# EAGLE schematic receiving end(3) (EAGLE 6.3)
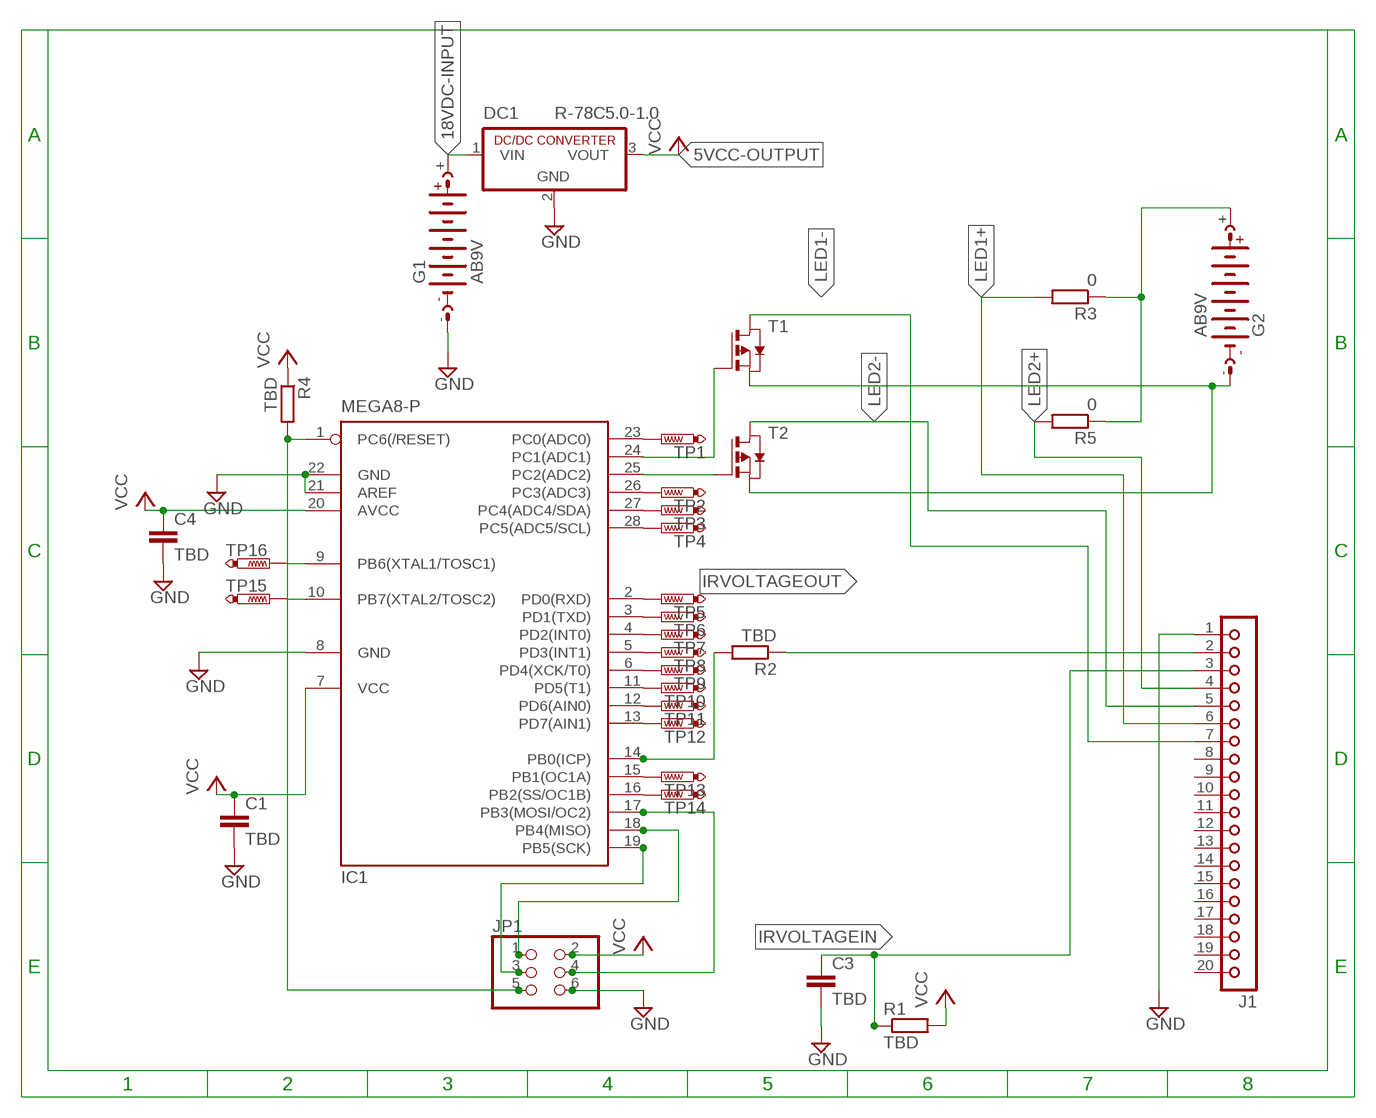
[diagram p0: schematic, sheet 1]

## Parts
C1  TBD  C-EUC0805  [C0805]
C3  TBD  C-EUC0805  [C0805]
C4  TBD  C-EUC0805  [C0805]
DC1  R-78C5.0-1.0  [SIP3]
G1  AB9V  [AB9V]
G2  AB9V  [AB9V]
IC1  MEGA8-P  [DIL28-3]
J1  JU20  [JU20]
JP1  PINHD-2X3  [2X03]
R1  TBD  R-EU_R0805  [R0805]
R2  TBD  R-EU_R0805  [R0805]
R3  0  R-EU_R0805  [R0805]
R4  TBD  R-EU_R0805  [R0805]
R5  0  R-EU_R0805  [R0805]
T1  PMOSSOT23ZXM61P02FTA  [SOT-23]
T2  PMOSSOT23ZXM61P02FTA  [SOT-23]
TP1  PTR1PAD1-20  [P1-20]
TP2  PTR1PAD1-20  [P1-20]
TP3  PTR1PAD1-20  [P1-20]
TP4  PTR1PAD1-20  [P1-20]
TP5  PTR1PAD1-20  [P1-20]
TP6  PTR1PAD1-20  [P1-20]
TP7  PTR1PAD1-20  [P1-20]
TP8  PTR1PAD1-20  [P1-20]
TP9  PTR1PAD1-20  [P1-20]
TP10  PTR1PAD1-20  [P1-20]
TP11  PTR1PAD1-20  [P1-20]
TP12  PTR1PAD1-20  [P1-20]
TP13  PTR1PAD1-20  [P1-20]
TP14  PTR1PAD1-20  [P1-20]
TP15  PTR1PAD1-20  [P1-20]
TP16  PTR1PAD1-20  [P1-20]

## Nets
5VCC-OUTPUT: C1.1 C4.1 DC1.3(VOUT) IC1.7(VCC) IC1.20(AVCC) JP1.2 R1.2 R4.1 ; supply symbol labelled VCC
18VDC-INPUT: DC1.1(VIN) G1.+
GND: J1.1
IRRECEIVERGND: C1.2 C3.2 C4.2 DC1.2(GND) G1.- IC1.8(GND) IC1.21(AREF) IC1.22(GND) JP1.6 ; supply symbol labelled GND
IRVOLTAGEIN: C3.1 J1.3 R1.1
IRVOLTAGEOUT: J1.2 R2.1
LED1+: J1.6 R3.2
LED1-: J1.7 T1.1(D)
LED2+: J1.4 R5.2
LED2-: J1.5 T2.1(D)
N$1: IC1.25(PC2(ADC2)) T2.3(G)
N$2: IC1.23(PC0(ADC0)) TP1.TP
N$3: IC1.26(PC3(ADC3)) TP2.TP
N$8: G2.- T1.2(S) T2.2(S)
N$9: G2.+ R3.1 R5.1
N$11: IC1.24(PC1(ADC1)) T1.3(G)
N$15: IC1.27(PC4(ADC4/SDA)) TP3.TP
N$16: IC1.28(PC5(ADC5/SCL)) TP4.TP
N$17: IC1.2(PD0(RXD)) TP5.TP
N$18: IC1.3(PD1(TXD)) TP6.TP
N$19: IC1.4(PD2(INT0)) TP7.TP
N$20: IC1.5(PD3(INT1)) TP8.TP
N$21: IC1.6(PD4(XCK/T0)) TP9.TP
N$22: IC1.11(PD5(T1)) TP10.TP
N$23: IC1.12(PD6(AIN0)) TP11.TP
N$24: IC1.13(PD7(AIN1)) TP12.TP
N$25: IC1.14(PB0(ICP)) R2.2
N$26: IC1.15(PB1(OC1A)) TP13.TP
N$27: IC1.16(PB2(SS/OC1B)) TP14.TP
N$28: IC1.17(PB3(MOSI/OC2)) JP1.4
N$29: IC1.18(PB4(MISO)) JP1.1
N$30: IC1.19(PB5(SCK)) JP1.3
N$31: IC1.9(PB6(XTAL1/TOSC1)) TP16.TP
N$32: IC1.10(PB7(XTAL2/TOSC2)) TP15.TP
N$35: IC1.1(PC6(/RESET)) JP1.5 R4.2
Unconnected: J1.8 J1.9 J1.10 J1.11 J1.12 J1.13 J1.14 J1.15 J1.16 J1.17 J1.18 J1.19 J1.20

## Library data of the parts
C1 C3 C4 = rcl:C-EU: CAPACITOR, European symbol
DC1 = dc-dc-converter:R-78C*-1.0: INNOLINE DC/DC-Converter 1.0 AMP SIP3 Single Output Source: Data sheet <http://www.mikrocontroller.net/attachment/150645/157764-da-01-en-DC_DC_WANDLER_R_78C5_0_1_0.pdf>
G1 G2 = battery:AB9V: 9-V BATTERY CLIP
IC1 = atmel:MEGA8-P: MICROCONTROLLER 8 Kbytes FLASH, 1 kbytes SRAM, 512 bytes EEPROM, USART, 4-channel 10 bit ADC, 2-channel 8 bit ADC Pin compatible with Atmega48, ATMega88, ATMega168 Source: avr.lbr; OC_FARNELL: unknown; OC_NEWARK: unknown
J1 = con-lsta:JU20: PIN HEADER; OC_FARNELL: unknown; OC_NEWARK: unknown
JP1 = pinhead:PINHD-2X3: PIN HEADER
R1-R5 = resistor:R-EU_: RESISTOR, European symbol
T1 T2 = solomon_library:PMOSSOT23: MOS FET; OC_FARNELL: unknown; OC_NEWARK: unknown
TP1-TP16 = testpad:PTR1: TEST PIN